# EAGLE schematic AFE_Pants_Powered (EAGLE 6.6.0)
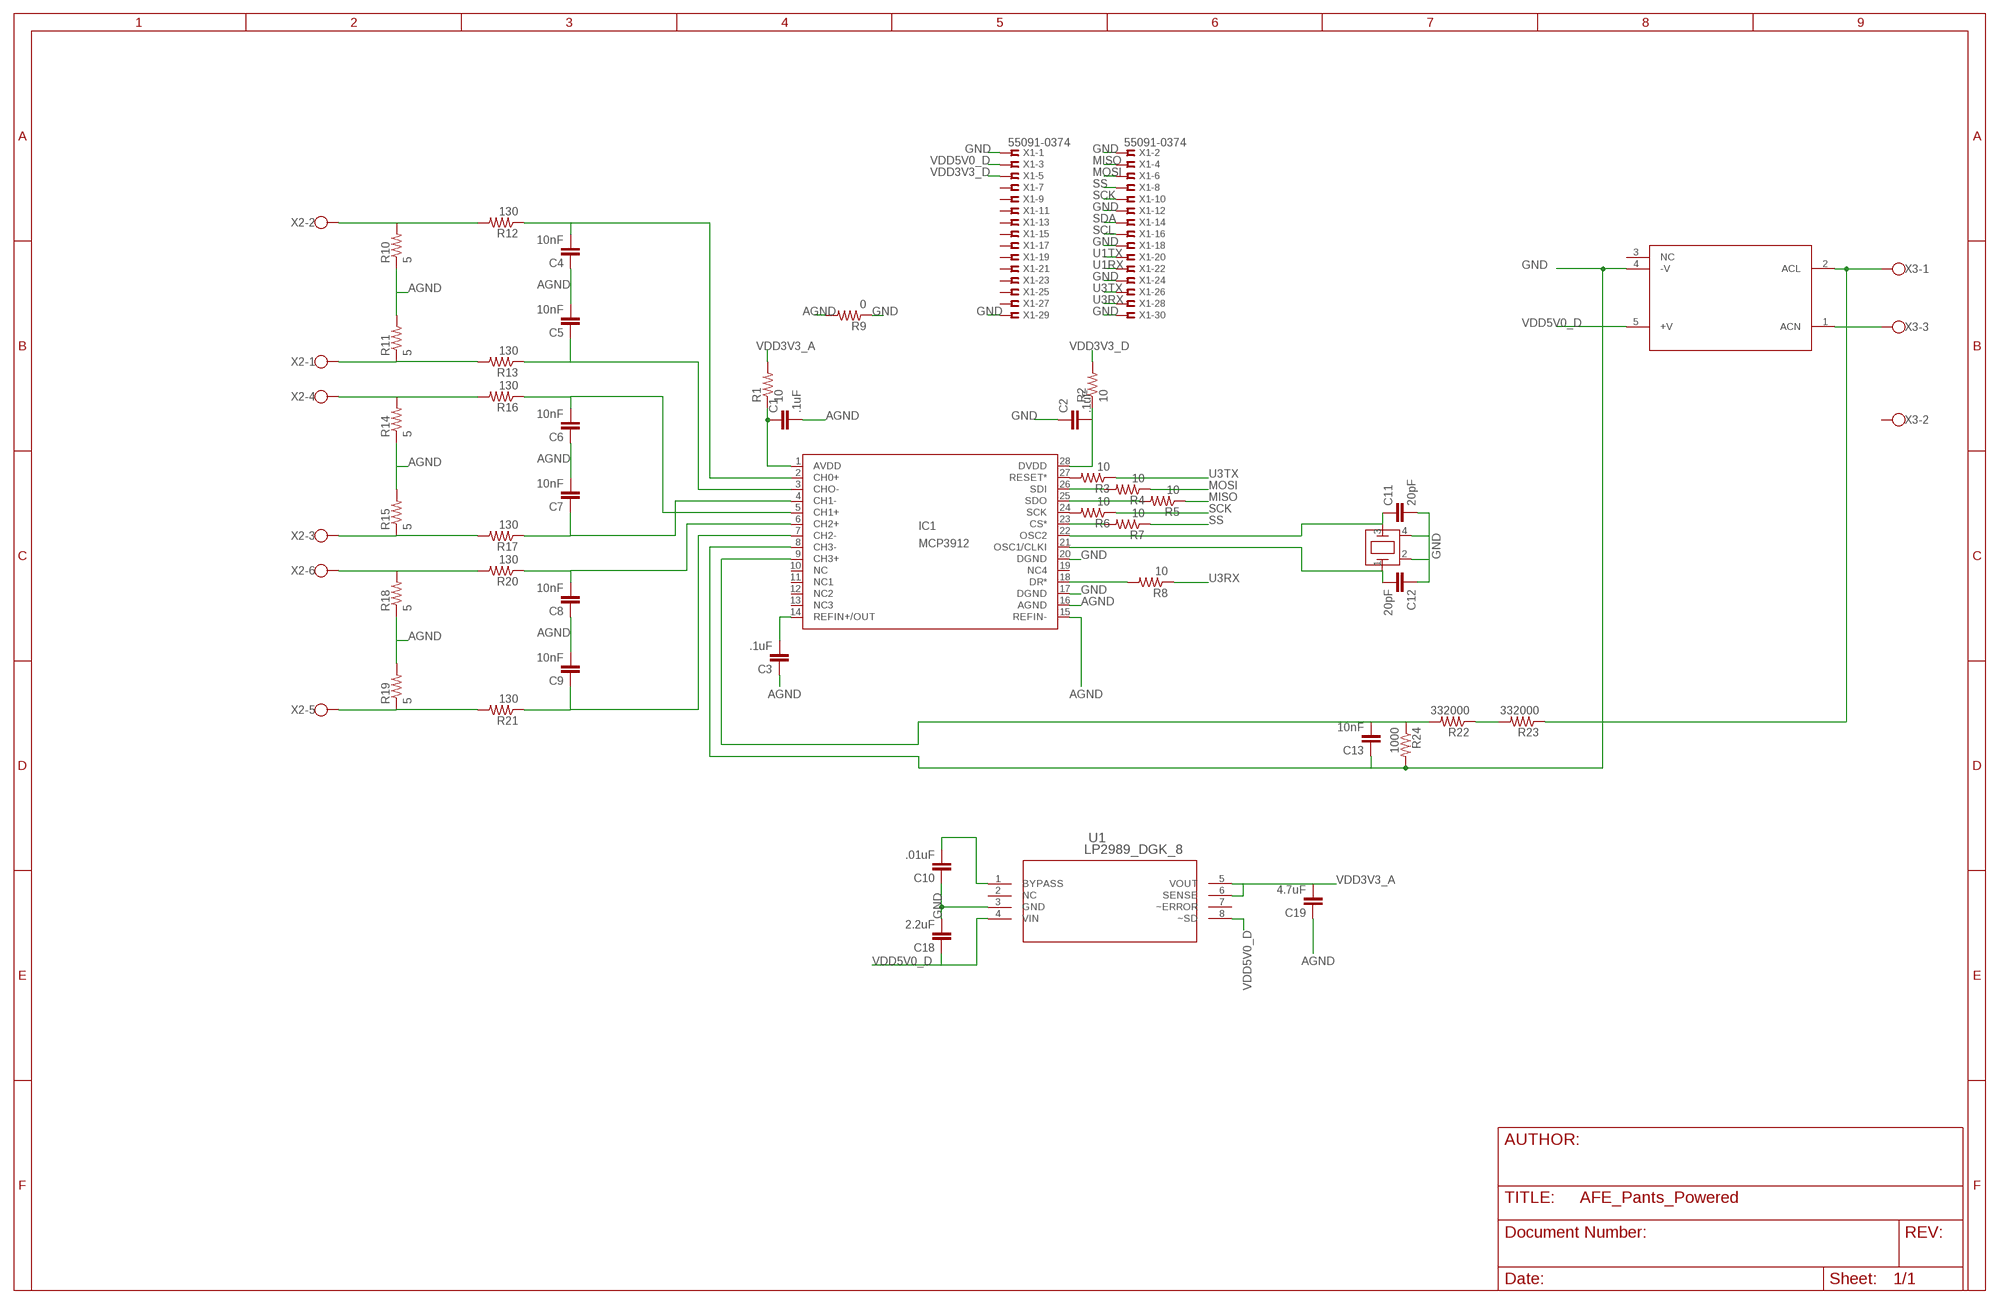
[diagram p0: schematic, sheet 1]

## Parts
C1  .1uF  CAP0805  [0805]
C2  .1uF  CAP0805  [0805]
C3  .1uF  CAP0805  [0805]
C4  10nF  CAP0805  [0805]
C5  10nF  CAP0805  [0805]
C6  10nF  CAP0805  [0805]
C7  10nF  CAP0805  [0805]
C8  10nF  CAP0805  [0805]
C9  10nF  CAP0805  [0805]
C10  .01uF  CAP0805  [0805]
C11  20pF  CAP0805  [0805]
C12  20pF  CAP0805  [0805]
C13  10nF  CAP0805  [0805]
C18  2.2uF  CAP0805  [0805]
C19  4.7uF  CAP0805  [0805]
IC1  MCP3912  [SSOP28]
R1  10  RESISTOR0805-RES  [0805]
R2  10  RESISTOR0805-RES  [0805]
R3  10  RESISTOR0805-RES  [0805]
R4  10  RESISTOR0805-RES  [0805]
R5  10  RESISTOR0805-RES  [0805]
R6  10  RESISTOR0805-RES  [0805]
R7  10  RESISTOR0805-RES  [0805]
R8  10  RESISTOR0805-RES  [0805]
R9  0  RESISTOR0805-RES  [0805]
R10  5  RESISTOR0805-RES  [0805]
R11  5  RESISTOR0805-RES  [0805]
R12  130  RESISTOR0805-RES  [0805]
R13  130  RESISTOR0805-RES  [0805]
R14  5  RESISTOR0805-RES  [0805]
R15  5  RESISTOR0805-RES  [0805]
R16  130  RESISTOR0805-RES  [0805]
R17  130  RESISTOR0805-RES  [0805]
R18  5  RESISTOR0805-RES  [0805]
R19  5  RESISTOR0805-RES  [0805]
R20  130  RESISTOR0805-RES  [0805]
R21  130  RESISTOR0805-RES  [0805]
R22  332000  RESISTOR0805-RES  [0805]
R23  332000  RESISTOR0805-RES  [0805]
R24  1000  RESISTOR0805-RES  [0805]
U1  LP2989_DGK_8  [MUA08A]
U$1  7M-12.000MEEQ-T  [7M-CRYSTAL]
U$2  ECE05US05  [ECE05US05]
X1  55091-0374  [55091-0374]
X2  W237-6  [W237-6]
X3  W237-103  [W237-103]

## Nets
AGND: C1.2 C3.1 C4.1 C5.2 C6.1 C7.2 C8.1 C9.2 C19.1 IC1.15(REFIN-) IC1.16(AGND) R9.2 R10.1 R11.2 R14.1 R15.2 R18.1 R19.2
GND: C2.1 C10.1 C11.2 C12.1 C13.1 C18.2 IC1.8(CH3-) IC1.17(DGND) IC1.20(DGND) R9.1 R24.2 U1.3(GND) U$1.2(GND1) U$1.4(GND2) U$2.4(-V) X1.1 X1.2 X1.12 X1.18 X1.24 X1.29 X1.30
MISO: R5.1 X1.4
MOSI: R4.1 X1.6
N$1: C1.1 IC1.1(AVDD) R1.1
N$2: IC1.27(RESET*) R3.2
N$3: IC1.26(SDI) R4.2
N$4: IC1.25(SDO) R5.2
N$5: IC1.24(SCK) R6.2
N$6: IC1.23(CS*) R7.2
N$7: IC1.18(DR*) R8.2
N$8: C2.2 IC1.28(DVDD) R2.1
N$9: C3.2 IC1.14(REFIN+/OUT)
N$10: R10.2 R12.2 X2.2
N$11: R11.1 R13.2 X2.1
N$12: R14.2 R16.2 X2.4
N$13: C4.2 IC1.2(CH0+) R12.1
N$14: C5.1 IC1.3(CHO-) R13.1
N$15: R15.1 R17.2 X2.3
N$16: C6.2 IC1.5(CH1+) R16.1
N$17: C7.1 IC1.4(CH1-) R17.1
N$18: R18.2 R20.2 X2.6
N$19: R19.1 R21.2 X2.5
N$20: C8.2 IC1.6(CH2+) R20.1
N$21: C9.1 IC1.7(CH2-) R21.1
N$23: C13.2 IC1.9(CH3+) R22.2 R24.1
N$24: C10.2 U1.1(BYPASS)
N$26: C11.1 IC1.22(OSC2) U$1.3(OSC2)
N$27: C12.2 IC1.21(OSC1/CLKI) U$1.1(OSC1)
N$28: R23.1 U$2.2(ACL) X3.1
N$29: U$2.1(ACN) X3.3
N$30: R22.1 R23.2
SCK: R6.1 X1.10
SCL: X1.16
SDA: X1.14
SS: R7.1 X1.8
U1RX: X1.22
U1TX: X1.20
U3RX: R8.1 X1.28
U3TX: R3.1 X1.26
VDD3V3_A: C19.2 R1.2 U1.5(VOUT) U1.6(SENSE)
VDD3V3_D: R2.2 X1.5
VDD5V0_D: C18.1 U1.4(VIN) U1.8(~SD) U$2.5(+V) X1.3
Unconnected: IC1.10(NC) IC1.11(NC1) IC1.12(NC2) IC1.13(NC3) IC1.19(NC4) U1.2(NC) U1.7(~ERROR) U$2.3(NC) X1.7 X1.9 X1.11 X1.13 X1.15 X1.17 X1.19 X1.21 X1.23 X1.25 X1.27 X3.2

## Library data of the parts
C1-C13 C18 C19 = SensorCape:CAP: Capacitor Standard 0603 ceramic capacitor, and 0.1" leaded capacitor.
IC1 = SensorCape:MCP3912: edit this description Auto generated by make-symbol-device-package-bsdl.ulp Rev. 43 Source:
R1-R24 = SensorCape:RESISTOR: Resistor Basic schematic elements and footprints for 0603, 1206, and PTH resistors.
U1 = SensorCape:LP2989_DGK_8; BASE_PN: LP2989; COMP: TypeLDO; LIBRARY: ReferenceLP2989AIMM; PARTNUMBER: LP2989AIMM-25; PIN: Count8; SYMBOL: NameLP2989AIMM-25; TYPE: LP2989AIMM-2.5; VENDOR: NationalSemiconductor; VERSION: 1
U$1 = SensorCape:7M-12.000MEEQ-T
U$2 = SensorCape:ECE05US05
X1 = SensorCape:55091-0374: 0.635 mm PITCH B TO B CONN. Source: http://www.molex.com/pdm_docs/sd/550911609_sd.pdf; OC_FARNELL: unknown; OC_NEWARK: unknown
X2 = con-wago-500:W237-6: WAGO SCREW CLAMP; OC_FARNELL: unknown; OC_NEWARK: unknown
X3 = con-wago-500:W237-103: WAGO SCREW CLAMP; MPN: 237-103; OC_FARNELL: unknown; OC_NEWARK: 18M7116